# EAGLE design Amp Kit v6.3.4 (EAGLE 9.6.2)
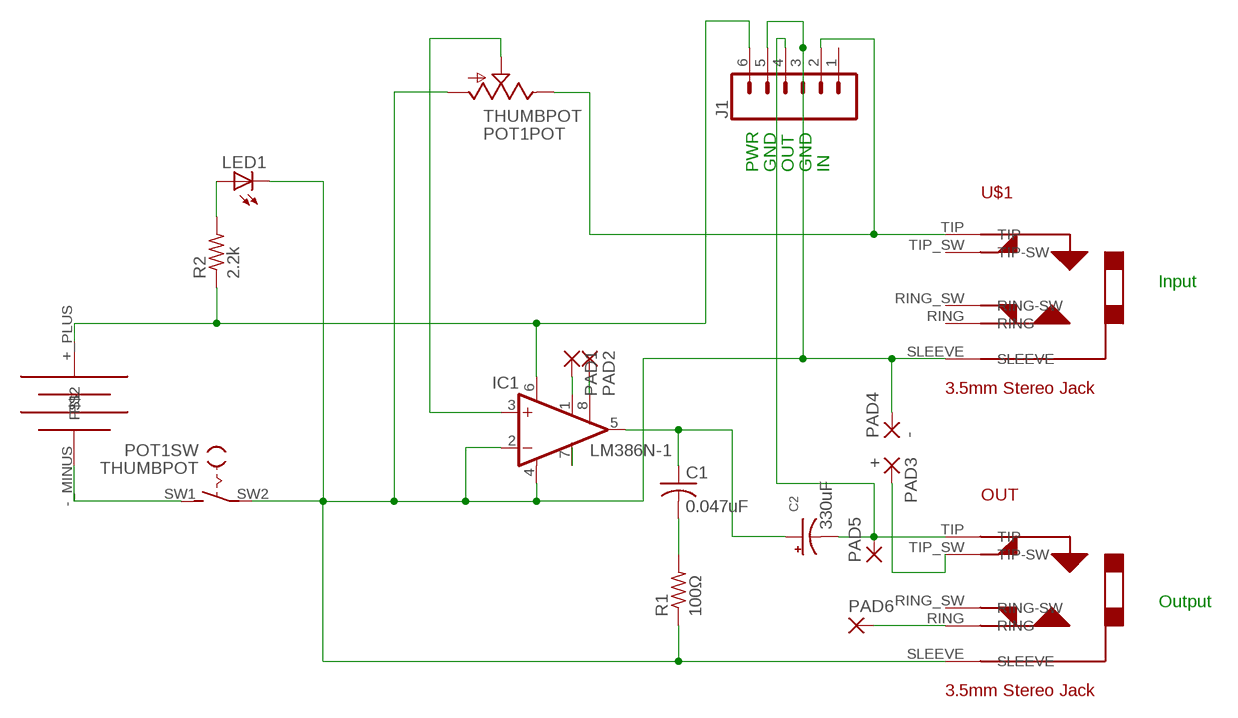
[diagram p0: schematic, sheet 1]

## Parts
C1  0.047uF  C-US050-024X044  [C050-024X044]
C2  330uF  CPOL-USE1.8-4  [E1,8-4]
IC1  LM386N-1  [DIL08]
J1  CONN_06NO_SILK_FEMALE_PTH  [1X06_NO_SILK]
LED1  LED5MM  [LED5MM]
OUT  CUI_STEREO_JACK  [CUI_STEREO_JACK]
PAD1  SMD2  [SMD1,27-2,54]
PAD2  SMD2  [SMD1,27-2,54]
PAD3  +  WIREPAD4,16O1,6  [4,16O1,6]
PAD4  -  WIREPAD4,16O1,6  [4,16O1,6]
PAD5  SMD2  [SMD1,27-2,54]
PAD6  SMD2  [SMD1,27-2,54]
POT1  THUMBPOT  [THUMBWHEEL]
R1  100Ω  R-US_0207/7  [0207/7]
R2  2.2k  R-US_0207/7  [0207/7]
U$1  CUI_STEREO_JACK  [CUI_STEREO_JACK]
U$2  9V_BATCLIP_AMP2  [9V_BATCLIP_AMP2]

## Nets
N$1: IC1.2(-IN) IC1.4(GND) J1.3 J1.5 LED1.K(C) OUT.SLEEVE PAD4.1(P) POT1.1(POT:A) POT1.SW2(SW:P) R1.1 U$1.SLEEVE
N$2: OUT.TIP_SW(TIP-SW) PAD3.1(P)
N$4: C1.1 C2.+ IC1.5(OUT)
N$5: IC1.3(+IN) POT1.2(POT:S)
N$6: IC1.1(GAIN) PAD1.1(P)
N$7: C2.- J1.4 OUT.TIP PAD5.1(P)
N$8: IC1.7(BYPASS)
N$9: J1.2 POT1.3(POT:E) U$1.TIP
N$10: LED1.A R2.2
N$11: POT1.SW1(SW:S) U$2.-_MINUS
N$12: IC1.8(GAIN) PAD2.1(P)
N$13: C1.2 R1.2
N$14: OUT.RING PAD6.1(P)
N$15: IC1.6(VS) J1.6 R2.1 U$2.+_PLUS
Unconnected: J1.1 OUT.RING_SW(RING-SW) U$1.RING U$1.RING_SW(RING-SW) U$1.TIP_SW(TIP-SW)

## Notes on the sheet
- PWR | GND | OUT | GND | IN
- Input
- Output

## Library data of the parts
C1 = adafruit:C-US: CAPACITOR, American symbol
C2 = rcl:CPOL-US: POLARIZED CAPACITOR, American symbol; SPICEPREFIX: C
IC1 = linear:LM386?-*: Low Voltage Audio Power Amplifier Source: http://cache.national.com/ds/LM/LM386.pdf
J1 = SparkFun-Connectors:CONN_06: Multi connection point. Often used as Generic Header-pin footprint for 0.1 inch spaced/style header connections On any of the 0.1 inch spaced packages, you can populate with these: Break Away Headers - Straight <https://www.sparkfun.com/products/116> (PRT-00116) Break Away Male Headers - Right Angle <https://www.sparkfun.com/products/553> (PRT-00553) Female Headers <https://www.sparkfun.com/products/115> (PRT-00115) Break Away Headers - Machine Pin <https://www.sparkfun.com/products/117> (PRT-00117) Break Away Female Headers - Swiss Machine Pin <https://www.sparkfun.com/products/743> (PRT-00743) Arduino Stackable Header - 6 Pin <https://www.sparkfun.com/products/9280> (PRT-09280) For SCREWTERMINALS and SPRING TERMINALS visit here: Screw Terimnals on SparkFun.com <https://www.sparkfun.com/search/results?term=Screw+Terminals> (5mm/3.5mm/2.54mm spacing) This device is also useful as a general connection point to wire up your design to another part of your project. Our various solder wires solder well into these plated through hole pads. Hook-Up Wire - Assortment (Stranded, 22 AWG) <https://www.sparkfun.com/products/11375> (PRT-11375) Hook-Up Wire - Assortment (Solid Core, 22 AWG) <https://www.sparkfun.com/products/11367> (PRT-11367) View the entire wire category on our website here <https://www.sparkfun.com/categories/141>; PROD_ID: CONN-08437
LED1 = adafruit:LED: LED OSRAM: - CHIPLED LG R971, LG N971, LY N971, LG Q971, LY Q971, LO R971, LY R971 LH N974, LH R974 LS Q976, LO Q976, LY Q976 LO Q996 - Hyper CHIPLED LW Q18S LB Q993, LB Q99A, LB R99A - SideLED LS A670, LO A670, LY A670, LG A670, LP A670 LB A673, LV A673, LT A673, LW A673 LH A674 LY A675 LS A676, LA A676, LO A676, LY A676, LW A676 LS A679, LY A679, LG A679 - Hyper Micro SIDELED® LS Y876, LA Y876, LO Y876, LY Y876 LT Y87S - SmartLED LW L88C, LW L88S LB L89C, LB L89S, LG L890 LS L89K, LO L89K, LY L89K LS L896, LA L896, LO L896, LY L896 - TOPLED LS T670, LO T670, LY T670, LG T670, LP T670 LSG T670, LSP T670, LSY T670, LOP T670, LYG T670 LG T671, LOG T671, LSG T671 LB T673, LV T673, LT T673, LW T673 LH T674 LS T676, LA T676, LO T676, LY T676, LB T676, LH T676, LSB T676, LW T676 LB T67C, LV T67C, LT T67C, LS T67K, LO T67K, LY T67K, LW E67C LS E67B, LA E67B, LO E67B, LY E67B, LB E67C, LV E67C, LT E67C LW T67C LS T679, LY T679, LG T679 LS T770, LO T770, LY T770, LG T770, LP T770 LB T773, LV T773, LT T773, LW T773 LH T774 LS E675, LA E675, LY E675, LS T675 LS T776, LA T776, LO T776, LY T776, LB T776 LHGB T686 LT T68C, LB T68C - Hyper Mini TOPLED® LB M676 - Mini TOPLED Santana® LG M470 LS M47K, LO M47K, LY M47K Source: http://www.osram.convergy.de/
OUT U$1 = Stereo_jack_with_holes:CUI_STEREO_JACK
PAD1 PAD2 PAD5 PAD6 = wirepad:SMD2: SMD PAD
PAD3 PAD4 = wirepad:WIREPAD: Wire PAD connect wire on PCB
POT1 = adafruit:THUMBPOT: Thumbwheel pot with switch Available in horizontal (Alpha RV121SF) or vertical (Xicon 311-1701)
R1 R2 = rcl:R-US_: RESISTOR, American symbol; SPICEPREFIX: R
U$2 = 9V_BatClip_Amp2:9V_BATCLIP_AMP2

## Board
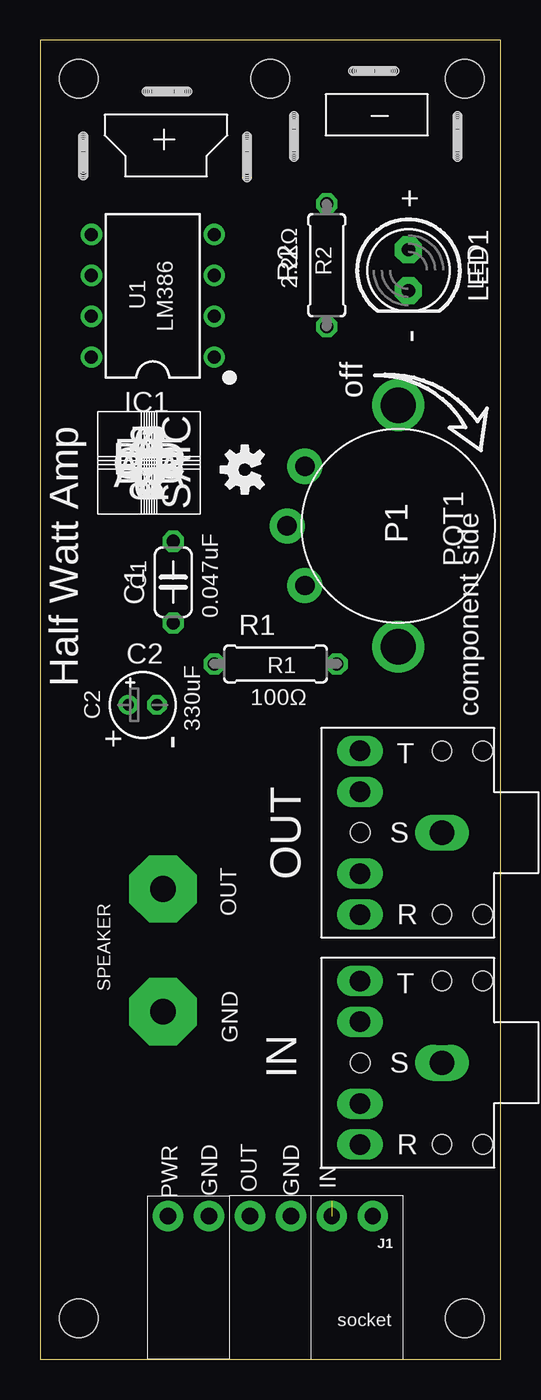
[diagram p1: board, top side]
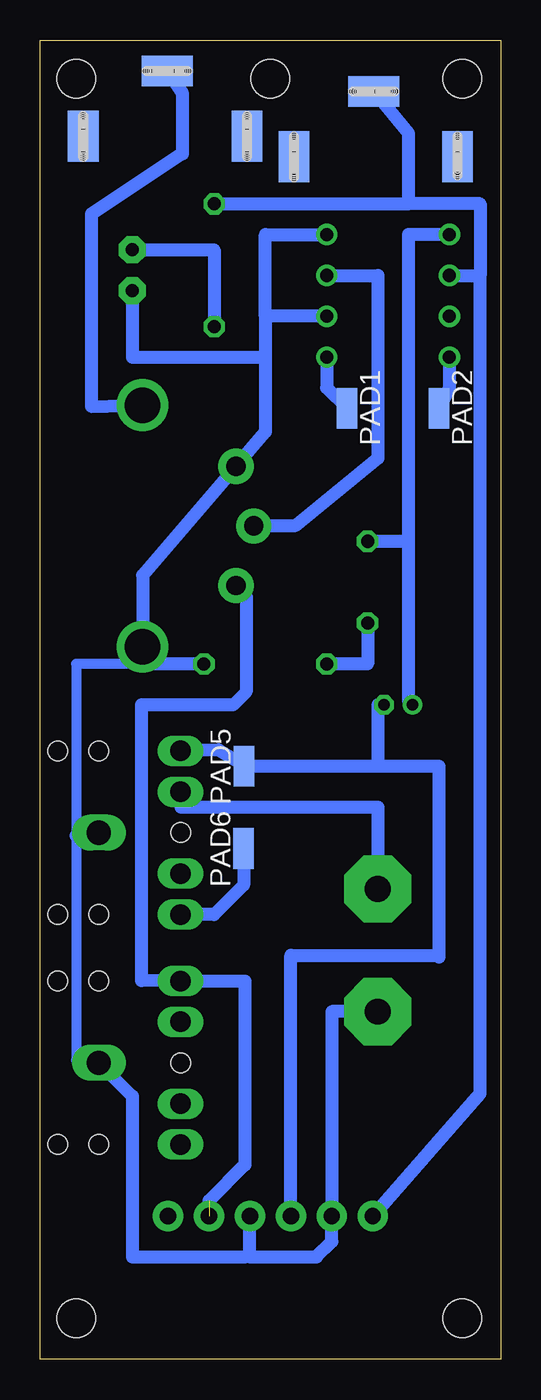
[diagram p2: board, bottom side, seen from below]

Size 28.57 x 81.91 mm. Coordinates in mm from the lower left corner, seen from the top.
Outline: 0,0 28.57,0 28.57,81.91 0,81.91 0,0
Copper layers (1*16): Top 0.035mm / dielectric 1.5mm / Bottom 0.035mm
Design rules "OthermillDRC_30_deg_v2 *": minimum track width 6mil, minimum drill 0.8mm, track to track 6mil, track to pad 6mil, pad to pad 6mil, via to via 6mil, smd to smd 0mil, copper to edge 0mil, drill to drill 6mil, minimum pad ring 10mil, minimum via ring 10mil, stop-mask expansion 1mil, vias tented up to drill 30mil, thermal gap 6mil
Holes 2.38 mm at 2.38,79.53 26.35,79.53 14.29,79.53 2.38,2.54 26.35,2.54

### Footprints (pad centres in the part's own frame; a part is rotated, then mirrored left to right if it is on the bottom)
C050-024X044 = drill 0.813 octagon: 1 -2.54,0; 2 2.54,0
E1,8-4 = drill 0.711 pad 1.168: + -0.889,0 | drill 0.711 pad 1.168 octagon: - 0.889,0
DIL08 = drill 0.813 pad 1.27: 1 -3.81,-3.81; 2 -1.27,-3.81; 3 1.27,-3.81; 4 3.81,-3.81; 5 3.81,3.81; 6 1.27,3.81; 7 -1.27,3.81; 8 -3.81,3.81
1X06_NO_SILK = drill 1.016 pad 1.88: 1 0,0; 2 2.54,0; 3 5.08,0; 4 7.62,0; 5 10.16,0; 6 12.7,0
LED5MM = drill 0.813 pad 1.676 octagon: A -1.27,0; K 1.27,0
CUI_STEREO_JACK = drill 1.27 long: RING 2.92,-5.08; RING_SW 2.92,-2.54; TIP 2.92,5.08; TIP_SW 2.92,2.54 | drill 1.5 long: SLEEVE 8,0 | hole 1.2: 8,5.08; 10.54,5.08; 2.92,0; 8,-5.08; 10.54,-5.08; 8,5.08; 10.54,5.08; 2.92,0; 8,-5.08; 10.54,-5.08
SMD1,27-2,54 = smd 1.27 x 2.54: 1 0,0
4,16O1,6 = drill 1.6 pad 4.166 octagon: 1 0,0
THUMBWHEEL = drill 1.2 pad 2.184: 1 -3.7,-5.8; 2 0,-6.9; 3 3.7,-5.8 | drill 2.2: SW1 -7.5,0; SW2 7.5,0
0207/7 = drill 0.813 octagon: 1 -3.81,0; 2 3.81,0
9V_BATCLIP_AMP2 = smd 1.905 x 3.175 bottom: +_PLUS 7.62,6.604; -_MINUS 8.89,-6.223 | smd 3.175 x 1.905 bottom: P$3 4.826,-11.43; P$4 4.826,-1.27; P$5 3.556,1.651; P$6 3.556,11.811 | hole 0.5: 2.413,11.811; 2.54,11.811; 2.667,11.811; 2.794,11.811; 2.921,11.811; 3.048,11.811; 3.175,11.811; 3.302,11.811; 3.429,11.811; 3.556,11.811; 3.683,11.811; 3.81,11.811; 3.937,11.811; 4.064,11.811; 4.191,11.811; 4.318,11.811; 4.445,11.811; 4.572,11.811; 4.699,11.811; 4.826,11.811; 7.62,7.874; 7.62,7.747; 7.62,7.62; 7.62,7.493; 7.62,7.366; 7.62,7.239; 7.62,7.112; 7.62,6.985; 7.62,6.858; 7.62,6.731; 7.62,6.604; 7.62,6.477; 7.62,6.35; 7.62,6.223; 7.62,6.096; 7.62,5.969; 7.62,5.842; 7.62,5.715; 7.62,5.588; 7.62,5.461; 7.62,5.334; 2.286,1.651; 2.413,1.651; 2.54,1.651; 2.667,1.651; 2.794,1.651; 2.921,1.651; 3.048,1.651; 3.175,1.651; 3.302,1.651; 3.429,1.651; 3.556,1.651; 3.683,1.651; 3.81,1.651; 3.937,1.651; 4.064,1.651; 4.191,1.651; 4.318,1.651; 4.445,1.651; 4.572,1.651; 4.572,1.651; 4.699,1.651; 4.699,1.651; 4.826,1.651; 3.556,-1.27; 3.683,-1.27; 3.81,-1.27; 3.937,-1.27; 4.064,-1.27; 4.191,-1.27; 4.318,-1.27; 4.445,-1.27; 4.572,-1.27; 4.699,-1.27; 4.826,-1.27; 4.953,-1.27; 5.08,-1.27; 5.207,-1.27; 5.334,-1.27; 5.461,-1.27; 5.588,-1.27; 5.715,-1.27; 5.842,-1.27; 5.842,-1.27; 5.969,-1.27; 6.096,-1.27; 8.89,-4.953; 8.89,-5.08; 8.89,-5.207; 8.89,-5.334; 8.89,-5.461; 8.89,-5.588; 8.89,-5.715; 8.89,-5.842; 8.89,-5.969; 8.89,-6.096; 8.89,-6.223; 8.89,-6.35; 8.89,-6.477; 8.89,-6.604; 8.89,-6.731; 8.89,-6.858; 8.89,-6.985; 8.89,-7.112; 8.89,-7.239; 8.89,-7.366; 8.89,-7.493; 3.556,-11.43; 3.683,-11.43; 3.683,-11.43; 3.81,-11.43; 3.937,-11.43; 4.064,-11.43; 4.191,-11.43; 4.318,-11.43; 4.445,-11.43; 4.572,-11.43; 4.699,-11.43; 4.826,-11.43; 4.953,-11.43; 5.08,-11.43; 5.207,-11.43; 5.334,-11.43; 5.461,-11.43; 5.588,-11.43; 5.715,-11.43; 5.842,-11.43; 5.969,-11.43; 6.096,-11.43; 2.413,11.811; 2.54,11.811; 2.667,11.811; 2.794,11.811; 2.921,11.811; 3.048,11.811; 3.175,11.811; 3.302,11.811; 3.429,11.811; 3.556,11.811; 3.683,11.811; 3.81,11.811; 3.937,11.811; 4.064,11.811; 4.191,11.811; 4.318,11.811; 4.445,11.811; 4.572,11.811; 4.699,11.811; 4.826,11.811; 7.62,7.874; 7.62,7.747; 7.62,7.62; 7.62,7.493; 7.62,7.366; 7.62,7.239; 7.62,7.112; 7.62,6.985; 7.62,6.858; 7.62,6.731; 7.62,6.604; 7.62,6.477; 7.62,6.35; 7.62,6.223; 7.62,6.096; 7.62,5.969; 7.62,5.842; 7.62,5.715; 7.62,5.588; 7.62,5.461; 7.62,5.334; 2.286,1.651; 2.413,1.651; 2.54,1.651; 2.667,1.651; 2.794,1.651; 2.921,1.651; 3.048,1.651; 3.175,1.651; 3.302,1.651; 3.429,1.651; 3.556,1.651; 3.683,1.651; 3.81,1.651; 3.937,1.651; 4.064,1.651; 4.191,1.651; 4.318,1.651; 4.445,1.651; 4.572,1.651; 4.572,1.651; 4.699,1.651; 4.699,1.651; 4.826,1.651; 3.556,-1.27; 3.683,-1.27; 3.81,-1.27; 3.937,-1.27; 4.064,-1.27; 4.191,-1.27; 4.318,-1.27; 4.445,-1.27; 4.572,-1.27; 4.699,-1.27; 4.826,-1.27; 4.953,-1.27; 5.08,-1.27; 5.207,-1.27; 5.334,-1.27; 5.461,-1.27; 5.588,-1.27; 5.715,-1.27; 5.842,-1.27; 5.842,-1.27; 5.969,-1.27; 6.096,-1.27; 8.89,-4.953; 8.89,-5.08; 8.89,-5.207; 8.89,-5.334; 8.89,-5.461; 8.89,-5.588; 8.89,-5.715; 8.89,-5.842; 8.89,-5.969; 8.89,-6.096; 8.89,-6.223; 8.89,-6.35; 8.89,-6.477; 8.89,-6.604; 8.89,-6.731; 8.89,-6.858; 8.89,-6.985; 8.89,-7.112; 8.89,-7.239; 8.89,-7.366; 8.89,-7.493; 3.556,-11.43; 3.683,-11.43; 3.683,-11.43; 3.81,-11.43; 3.937,-11.43; 4.064,-11.43; 4.191,-11.43; 4.318,-11.43; 4.445,-11.43; 4.572,-11.43; 4.699,-11.43; 4.826,-11.43; 4.953,-11.43; 5.08,-11.43; 5.207,-11.43; 5.334,-11.43; 5.461,-11.43; 5.588,-11.43; 5.715,-11.43; 5.842,-11.43; 5.969,-11.43; 6.096,-11.43

### Placement (x,y rotation side)
C1  8.26,48.26 270 top
C2  6.35,40.64 0 top
IC1  6.99,66.04 90 top
J1  20.64,8.89 180 top
LED1  22.86,67.63 270 top
OUT  16.94,32.7 0 top
PAD1  9.53,59.05 180 bottom
PAD2  3.81,59.05 180 bottom
PAD3  7.62,29.21 0 top
PAD4  7.62,21.59 0 top
PAD5  15.93,36.83 0 bottom
PAD6  15.95,31.72 0 bottom
POT1  22.23,51.75 270 top
R1  14.61,43.18 180 top
R2  17.78,67.94 270 top
U$1  16.94,18.42 0 top
U$2  14.48,71.12 90 top
U$4  [OSHW-LOGO-S]  12.7,55.24 90 top

### Tracks (layer width: path | path; a pad name or v marks a point on that pad's centre or on a via)
N$1
  Bottom 0.61: 22.23,43.18 26.35,43.18 26.35,32.52 26.35,18.57 U$1.SLEEVE
  Bottom 0.813: IC1.4 14.61,69.85 14.61,64.77 | 14.61,64.77 14.61,62.23 | 14.61,62.23 14.61,57.59 POT1.1 22.23,48.7 POT1.SW2 22.23,43.18 R1.1 | IC1.2 14.61,64.77 | 26.35,32.52 OUT.SLEEVE | LED1.K 22.86,62.23 14.61,62.23 | PAD4.1 10.48,21.59 J1.5 10.48,7.3 11.43,6.35 15.56,6.35 J1.3 | U$1.SLEEVE 22.86,16.34 22.86,6.35 15.88,6.35
N$2
  Bottom 0.813: PAD3.1 7.62,34.29 19.84,34.29 OUT.TIP_SW
N$4
  Bottom 0.61: 5.71,40.89 C2.+
  Bottom 0.813: IC1.5 5.71,69.85 5.71,50.8 | C1.1 5.71,50.8 | 5.71,50.8 5.71,40.89
N$5
  Bottom 0.813: IC1.3 7.62,67.31 7.62,55.96 12.79,51.75 POT1.2
N$6
  Bottom 0.813: IC1.1 10.79,60.33 PAD1.1
N$7
  Bottom 0.813: 7.62,36.83 7.62,40.64 C2.- | OUT.TIP 17.51,37.84 15.88,36.83 PAD5.1 7.62,36.83 | 7.62,36.83 3.81,36.83 3.81,24.96 3.93,25.08 13.02,25.08 J1.4
N$9  (1 unrouted)
  Bottom 0.813: POT1.3 15.79,47.42 15.79,41.45 16.6,40.65 22.29,40.65 22.29,23.53 U$1.TIP 15.88,23.49 15.88,12.06 18.1,9.84
N$10
  Bottom 0.813: LED1.A 17.78,68.9 R2.2
N$11
  Bottom 0.813: POT1.SW1 25.4,59.17 25.4,71.12 19.75,74.87 19.75,78.61 U$2.-_MINUS
N$12
  Bottom 0.813: IC1.8 3.17,60.33 PAD2.1
N$13
  Bottom 0.813: C1.2 8.26,43.18 R1.2
N$14
  Bottom 0.508: PAD6.1 15.98,31.75
  Bottom 0.813: PAD6.1 15.95,29.45 17.78,27.62 OUT.RING
N$15
  Bottom 0.813: U$2.+_PLUS 5.71,76.14 5.71,71.75 | R2.1 5.71,71.75 | 1.27,67.31 1.27,71.75 5.71,71.75 | IC1.6 1.27,67.31 | 1.27,67.31 1.27,16.51 J1.6

### Text on the board
tSilk: + | R2 | 2.2kΩ | LED | U1 | LM386 | - | off | SAIC | 0.047uF | P1 | C1 | 330uF | Half Watt Amp | R1 | C2 | 100Ω | component side | + | - | OUT | OUT | SPEAKER | GND | IN | PWR | GND | OUT | GND | IN | socket
_bsilk: + | Gain Cap. | v6.3.4 SAIC 2021 | SOLDER SIDE | stereo jumper | OUT | GND | POWER | OUT | IN